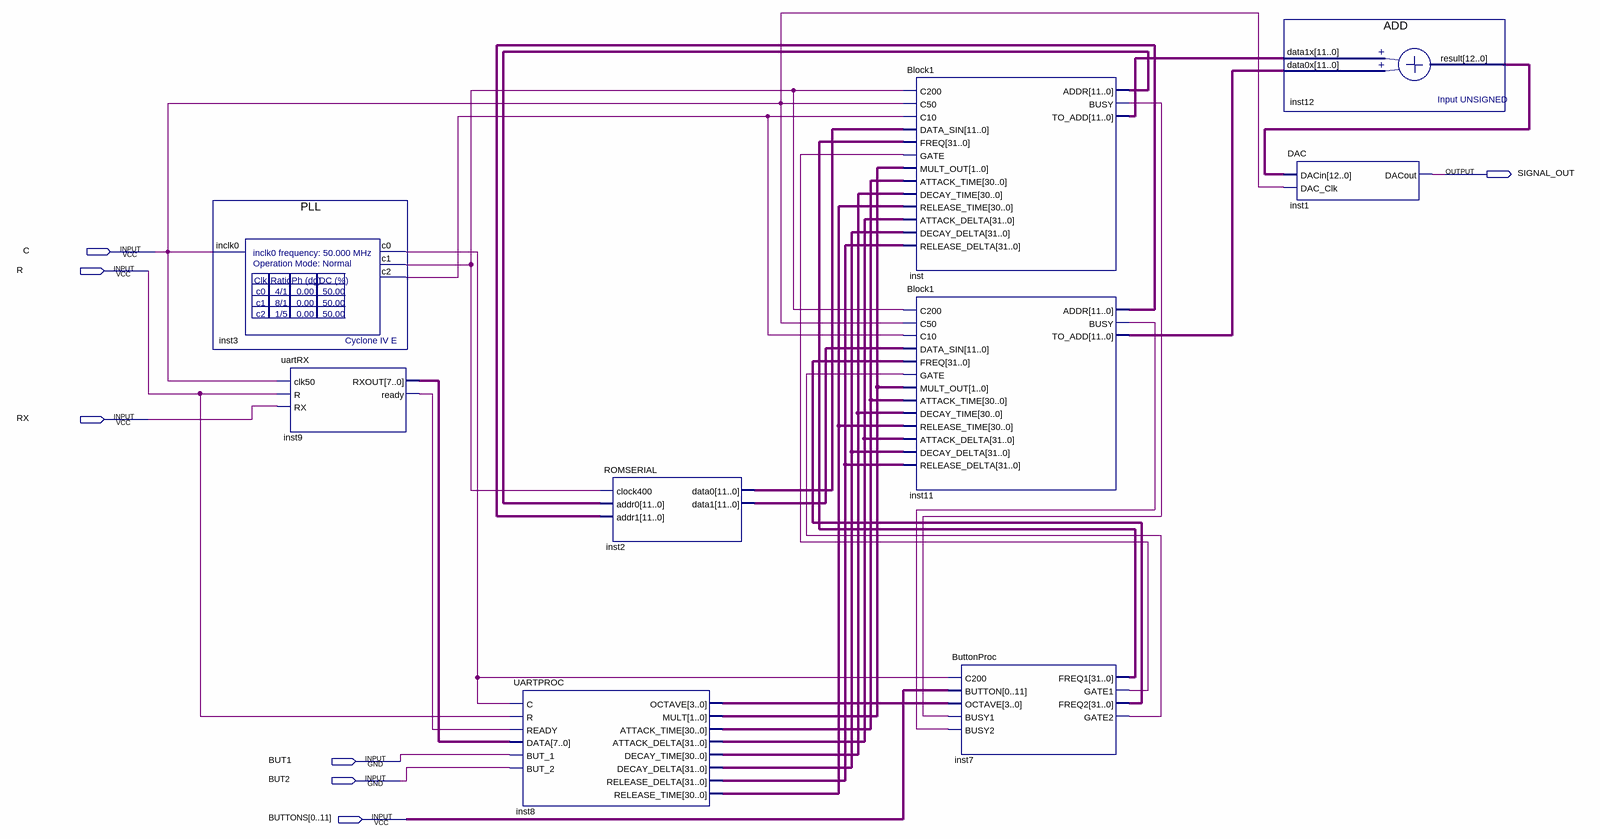
[diagram p0: schematic sheet]
// Quartus schematic MAINDIAGRAM.bdf as structural Verilog: 9 symbols, 7 pins
module MAINDIAGRAM (
  input  C,
  input  R,
  input  RX,
  input  BUT1,
  input  BUT2,
  input  [0:11] BUTTONS,
  output SIGNAL_OUT
);

  wire inst3_c0, inst3_c1, inst3_c2, inst7_gate1, inst7_gate2, inst9_ready, inst11_busy, inst_busy;
  wire [1:0] inst8_mult;
  wire [3:0] inst8_octave;
  wire [7:0] inst9_rxout;
  wire [11:0] inst2_data0, inst2_data1, inst11_addr, inst11_to_add, inst_addr, inst_to_add;
  wire [12:0] inst12_result;
  wire [30:0] inst8_attack_time, inst8_decay_time, inst8_release_time;
  wire [31:0] inst7_freq1, inst7_freq2, inst8_attack_delta, inst8_decay_delta, inst8_release_delta;

  PLL inst3 (.inclk0(C), .c0(inst3_c0), .c1(inst3_c1), .c2(inst3_c2));
  uartRX inst9 (.clk50(C), .R(R), .RX(RX), .RXOUT(inst9_rxout), .ready(inst9_ready));
  UARTPROC inst8 (
    .C(inst3_c0), .R(R), .READY(inst9_ready), .DATA(inst9_rxout), .BUT_1(BUT1), .BUT_2(BUT2),
    .OCTAVE(inst8_octave), .MULT(inst8_mult), .ATTACK_TIME(inst8_attack_time),
    .ATTACK_DELTA(inst8_attack_delta), .DECAY_TIME(inst8_decay_time), .DECAY_DELTA(inst8_decay_delta),
    .RELEASE_DELTA(inst8_release_delta), .RELEASE_TIME(inst8_release_time));
  ROMSERIAL inst2 (
    .clock400(inst3_c1), .addr0(inst_addr), .addr1(inst11_addr), .data0(inst2_data0), .data1(inst2_data1));
  Block1 inst (
    .C200(inst3_c1), .C50(C), .C10(inst3_c2), .DATA_SIN(inst2_data0), .FREQ(inst7_freq1), .GATE(inst7_gate1),
    .MULT_OUT(inst8_mult), .ATTACK_TIME(inst8_attack_time), .DECAY_TIME(inst8_decay_time),
    .RELEASE_TIME(inst8_release_time), .ATTACK_DELTA(inst8_attack_delta), .DECAY_DELTA(inst8_decay_delta),
    .RELEASE_DELTA(inst8_release_delta), .ADDR(inst_addr), .BUSY(inst_busy), .TO_ADD(inst_to_add));
  Block1 inst11 (
    .C200(inst3_c1), .C50(C), .C10(inst3_c2), .DATA_SIN(inst2_data1), .FREQ(inst7_freq2), .GATE(inst7_gate2),
    .MULT_OUT(inst8_mult), .ATTACK_TIME(inst8_attack_time), .DECAY_TIME(inst8_decay_time),
    .RELEASE_TIME(inst8_release_time), .ATTACK_DELTA(inst8_attack_delta), .DECAY_DELTA(inst8_decay_delta),
    .RELEASE_DELTA(inst8_release_delta), .ADDR(inst11_addr), .BUSY(inst11_busy), .TO_ADD(inst11_to_add));
  ButtonProc inst7 (
    .C200(inst3_c0), .BUTTON(BUTTONS), .OCTAVE(inst8_octave), .BUSY1(inst_busy), .BUSY2(inst11_busy),
    .FREQ1(inst7_freq1), .GATE1(inst7_gate1), .FREQ2(inst7_freq2), .GATE2(inst7_gate2));
  ADD inst12 (.data1x(inst_to_add), .data0x(inst11_to_add), .result(inst12_result));
  DAC inst1 (.DACin(inst12_result), .DAC_Clk(C), .DACout(SIGNAL_OUT));
endmodule
